# Altium schematic sheet ClosedLoop_Drive_MC_IBT_2.SchDoc
size A4; SheetNumber: 6; SheetTotal: 8
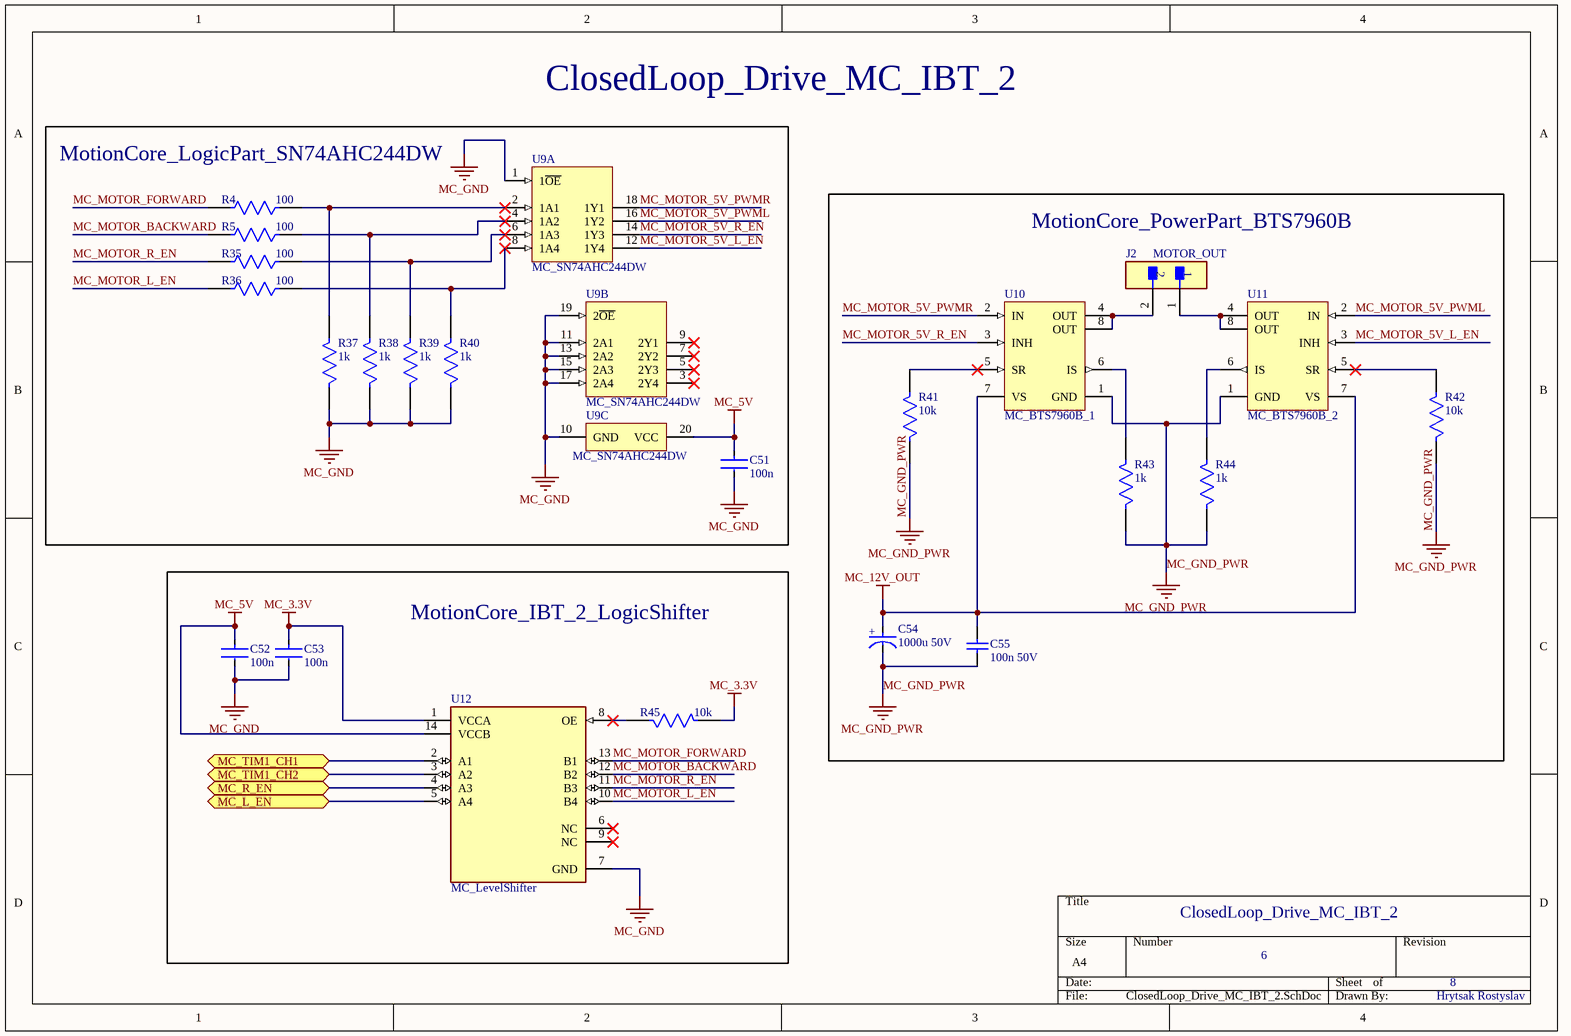
[diagram p0: ClosedLoop_Drive_MC_IBT_2.SchDoc]

## Parts
C51  100n  [FP-0805-L_2_01_0_2-W_1_25-MFG]
C52  100n  [FP-0805-L_2_01_0_2-W_1_25-MFG]
C53  100n  [FP-0805-L_2_01_0_2-W_1_25-MFG]
C54  1000u 50V  [FP-RAD-TH-D_16_0_5-L_25_2-MFG]
C55  100n 50V  [CAPC2013X135X45ML10T25]
J2  MOTOR_OUT  [FP-TSW-102-07-F-S-MFG]
R4  100  [FP-MCU0805-IPC_A]
R5  100  [FP-MCU0805-IPC_A]
R35  100  [FP-MCU0805-IPC_A]
R36  100  [FP-MCU0805-IPC_A]
R37  1k  [FP-MCU0805-IPC_A]
R38  1k  [FP-MCU0805-IPC_A]
R39  1k  [FP-MCU0805-IPC_A]
R40  1k  [FP-MCU0805-IPC_A]
R41  10k  [FP-MCU0805-IPC_A]
R42  10k  [FP-MCU0805-IPC_A]
R43  1k  [FP-MCU0805-IPC_A]
R44  1k  [FP-MCU0805-IPC_A]
R45  10k  [FP-MCU0805-IPC_A]
U9  MC_SN74AHC244DW  [DW0020A_N]  (parts A,B,C of 3)
U10  MC_BTS7960B_1  [INF-P-TO-263-7-6_M]
U11  MC_BTS7960B_2  [INF-P-TO-263-7-6_M]
U12  MC_LevelShifter  [FP-PW0014A-IPC_C]

## Blocks framed on the sheet
MotionCore_LogicPart_SN74AHC244DW: C51 R4 R5 R35-R40 U9
MotionCore_PowerPart_BTS7960B: C54 C55 J2 R41-R44 U10 U11
MotionCore_IBT_2_LogicShifter: C52 C53 R45 U12

## Ports
MC_L_EN (bidir, see ClosedLoop_Drive_MotionCore[3C]), MC_R_EN (bidir, see ClosedLoop_Drive_MotionCore[3C]), MC_TIM1_CH1 (bidir, see ClosedLoop_Drive_MotionCore[1C]), MC_TIM1_CH2 (bidir, see ClosedLoop_Drive_MotionCore[1C])

## Nets
MC_3.3V: C53.1 R45.2 U12.1(VCCA)
MC_5V: C51.1 C52.1 U9.20(VCC) U12.14(VCCB)
MC_12V_OUT: C54.2(A) C55.2 U10.7(VS) U11.7(VS)
MC_GND: C51.2 C52.2 C53.2 R37.1 R38.1 R39.1 R40.1 U9.1(1~{OE}) U9.10(GND) U9.11(2A1) U9.13(2A2) U9.15(2A3) U9.17(2A4) U9.19(2~{OE}) U12.7(GND)
MC_GND_PWR: C54.1(C) C55.1 R41.1 R42.1 R43.1 R44.1 U10.1(GND) U11.1(GND)
MC_L_EN: U12.5(A4) ; port MC_L_EN
MC_MOTOR_5V_L_EN: U9.12(1Y4) U11.3(INH)
MC_MOTOR_5V_PWML: U9.16(1Y2) U11.2(IN)
MC_MOTOR_5V_PWMR: U9.18(1Y1) U10.2(IN)
MC_MOTOR_5V_R_EN: U9.14(1Y3) U10.3(INH)
MC_MOTOR_BACKWARD: R5.2 U12.12(B2)
MC_MOTOR_FORWARD: R4.2 U12.13(B1)
MC_MOTOR_L_EN: R36.2 U12.10(B4)
MC_MOTOR_R_EN: R35.2 U12.11(B3)
MC_R_EN: U12.4(A3) ; port MC_R_EN
MC_TIM1_CH1: U12.2(A1) ; port MC_TIM1_CH1
MC_TIM1_CH2: U12.3(A2) ; port MC_TIM1_CH2
NetJ2_1: J2.1 U11.4(OUT) U11.8(OUT)
NetJ2_2: J2.2 U10.4(OUT) U10.8(OUT)
NetR4_1: R4.1 R37.2 U9.2(1A1)
NetR5_1: R5.1 R38.2 U9.4(1A2)
NetR35_1: R35.1 R39.2 U9.6(1A3)
NetR36_1: R36.1 R40.2 U9.8(1A4)
NetR41_2: R41.2 U10.5(SR)
NetR42_2: R42.2 U11.5(SR)
NetR43_2: R43.2 U10.6(IS)
NetR44_2: R44.2 U11.6(IS)
NetR45_1: R45.1 U12.8(OE)

Not connected (* = marked no-connect by the designer): U9 3(2Y4)* 5(2Y3)* 7(2Y2)* 9(2Y1)*; U12 6(NC)* 9(NC)*

## Notes on the sheet
- ClosedLoop_Drive_MC_IBT_2
- 6
- 8
- Hrytsak Rostyslav
- (in symbol CMP-05427-000625-1) +

## Library data of the parts
C51-C53 = CMP-07738-122049624-1: 0805; Tolerance: 10%; Dielectric: X7R; Material: Ceramic; Voltage Rating (DC): 100V; Capacitance: 1µF; Case/Package: 0805; Height: 1.4mm; Voltage Rating: 100V; Schedule B: 8532240020; NexarPartId: 122049624; RoHS: Compliant; Lifecycle Status: Production; Min Operating Temperature: -55°C; Max Operating Temperature: 125°C
C54 = CMP-05427-000625-1: Aluminum Electrolytic Capacitors (Radial Lead Type) 1000uF ±20% 50V; Polarity: Polar; ESR (Equivalent Series Resistance): 16mR; Ripple Current: 3.32A; Life (Hours): 10000Hour; Lead Diameter: 0.8mm; Dielectric Material: Aluminium; Lead/Base Style: Straight; Capacitance: 1mF; RoHS Compliant: Yes; Mount: Through Hole; Voltage Rating: 50V; Lead Free: Lead Free; Packaging: Bulk; Min Operating Temperature: -40°C; Package Quantity: 100; Max Operating Temperature: 105°C; Radiation Hardening: No; Termination: Radial; Construction: RADIAL; Height: 25mm; Length: 25mm; Tolerance: 20%; Number of Pins: 2; Ripple Current (AC): 3.32A; Diameter: 16mm; Case/Package: Radial; Impedance: 16mR; Height - Seated (Max): 1.063inch; Voltage: 50V; Voltage Rating (DC): 50V; Series: FR; Lead Pitch: 7.5mm
C55 = CMP-2100-03644-1: Chip Capacitor, 0.1 uF, +/- 10%, 50 V, -55 to 125 degC, 0805 (2012 Metric), RoHS, Tape and Reel; Manufacturer: Murata; Capacitance: 100nF; Insulation Resistance: 10GR; Dielectric Material: Ceramic; Dielectric: X7R; Package Description: 2-Pin Surface Mount Device, Body 2 x 1.25 mm; Manufacturer URL: http://www.murata.com/; Case Code (Imperial): 0805; Voltage: 50V; Datasheet URL: http://psearch.en.murata.com/capacitor/product/GRM21BR71H104KA01%23.pdf; Termination: SMD/SMT; Lead Free: LeadFree; Package Quantity: 1; Mount: SurfaceMount; REACH SVHC: Unknown; Thickness: 0.053inch; Height: 1.25mm; Case/Package: 0805; Voltage Rating: 50V; Width: 0.049inch; Case Code (Metric): 2012; Material: Ceramic; Min Operating Temperature: -55degC; RoHSCompliant: true; Datasheet Version: 42675.0; Voltage Rating (DC): 50V; Tolerance: 10%; Package Reference: 0805; Depth: 1.25mm; Length: 2mm; Max Operating Temperature: 125degC; Packaging: TapeandReel; Number of Pins: 2; Radiation Hardening: No
J2 = CMP-02766-001458-1: CONN HEADER VERT 2POS 2.54MM; Gender: Male; Max Current Rating: 7.6A; Number of Contacts: 2; Max Voltage Rating (AC): 550V; Orientation: Straight; Depth: 2.54mm; Series: TSW; Package Quantity: 1; Min Operating Temperature: -55°C; Max Operating Temperature: 125°C; Contact Type: Male Pin; Contact Shape: Square; Color: Black; Housing Color: Black; Connector Type: Header; Fastening Type: Pull; Radiation Hardening: No; Pitch: 2.54mm; Housing Material: Polyester; Mount: Through Hole; Number of Positions: 2; Number of Rows: 1; Contact Material: Bronze; Insulation Color: Black; Contact Finish - Mating: GOLD; Termination: Solder; Insulation Material: PBT; Length: 5.08mm; Flammability Rating: UL94 V-0; Contact Mating Length: 0.23inch; REACH SVHC: No SVHC; Contact Plating: Gold; RoHS Compliant: Yes; Packaging: Bulk
R4 R5 R35-R45 = CMP-02407-001153-1: 0805; Power Rating: 200mW; Temperature Coefficient: 25ppm/°C; Voltage Rating: 150V; Resistance: 4.99kR; Tolerance: 0.5%; Case Code (Imperial): 0805; Features: Automotive AEC-Q200; Case Code (Metric): 2012; Weight: 0.000162oz; Width: 0.049inch; Packaging: Tape and Reel; Composition: Thin Film; Height: 0.024inch; Termination: SMD/SMT; Number of Terminations: 2; Min Operating Temperature: -55°C; Length: 0.079inch; Package Quantity: 5000; Max Operating Temperature: 175°C; Case/Package: 0805; Max Power Dissipation: 200mW
U9 = CMP-0440-00700-3: Octal Buffers/Drivers With 3-State Outputs, DW0020A, TUBE; Manufacturer: Texas Instruments; tpd @ Nom Voltage(Max)(ns): 11,8.5; Output Type: CMOS; F @ Nom Voltage(Max)(Mhz): 110; VCC(Max)(V): 5.5; Voltage(Nom)(V): 3.3,5; VCC(Min)(V): 2; Bits(#): 8; Rating: Catalog; ICC @ Nom Voltage(Max)(mA): 0.04; DatasheetVersion: SCLS226K; PackageReference: DW0020A; Operating Temperature Range(C): -40 to 85; Input Type: CMOS; Code_JEDEC: MS-013; Generic Part Number: SN74AHC244; PackageVersion: http://www.ti.com/lit/ml/mpds173a/mpds173a.pdf
U10 U11 = CMP-1114-00025-1: High Current PN Half Bridge NovalithIC, -40 to 150 degC, P-TO-263-7-6; Manufacturer: Infineon; Iq (typ): 7 uA; Green: FALSE; ComponentLink1Description: Manufacturer URL; Halogen-free: FALSE; PackageDescription: 7-Pin Plastic Transistor Single Outline Package, 9.9 x 9.2 mm Body, 1.27 mm Pitch; ComponentLink2Description: Datasheet; ComponentLink3Description: Package Specification; ComponentLink1URL: http://www.infineon.com/; ComponentLink2URL: http://www.infineon.com/dgdl/BTS7960_Datasheet.pdf?folderId=db3a304412b407950112b408e8c90004&fileId=db3a304412b407950112b43945006d5d&location=en.Products.Automotive_ICs.Motor_Drivers__Automotive_.Integrated_High_Current_Motor_Drivers__NovalithIC____Trilith; ComponentLink3URL: http://www.infineon.com/dgdl/BTS7970B_Datasheet.pdf?folderId=db3a304412b407950112b408e8c90004&fileId=db3a304412b407950112b43949b36d61&sId=db3a30433d68e984013d7db637dc5e6a; PackageReference: P-TO-263-7-6; PackageVersion: May-06; Mounting Technology: Surface Mount; RevisionNote: Re-Activated Devices; PartNumber: BTS7960B; DatasheetVersion: Rev. 1.1
U12 = CMP-04899-000064-1: IC TRNSLTR BIDIRECTIONAL 14TSSOP; Min Supply Voltage: 1.65V; Quiescent Current: 14.4uA; Data Rate: 24Mbps; Logic Function: Translator; Number of Circuits: 1; Number of Bits: 4; Low Level Output Current: 1mA; Max Supply Voltage: 5.5V; High Level Output Current: -20uA; Operating Supply Current: 25uA; Propagation Delay: 4.6ns; Contact Plating: Gold; Package Quantity: 2000; Number of Pins: 14; Lead Free: Lead Free; Weight: 0.004949oz; Min Operating Temperature: -40°C; Number of Channels: 4; Packaging: Tape and Reel; Mount: Surface Mount; Max Operating Temperature: 125°C; Case/Package: TSSOP; Channel Type: Bidirectional; RoHS Compliant: Yes; Radiation Hardening: No